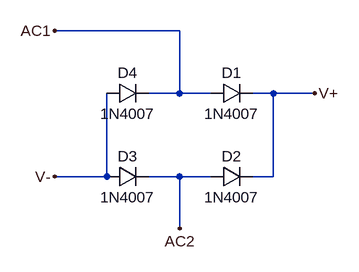
[diagram p0: schematic Rectificador de onda completa.asc]
Rectificador de onda completa.asc, the LTspice schematic file:
Version 4
SHEET 1 880 680
WIRE 160 32 -32 32
WIRE 160 128 160 32
WIRE 160 128 112 128
WIRE 208 128 160 128
WIRE 304 128 272 128
WIRE 368 128 304 128
WIRE 48 256 48 128
WIRE 48 256 -32 256
WIRE 160 256 112 256
WIRE 208 256 160 256
WIRE 304 256 304 128
WIRE 304 256 272 256
WIRE 160 336 160 256
FLAG -32 32 AC1
FLAG -32 256 V-
FLAG 368 128 V+
FLAG 160 336 AC2
SYMBOL diode 208 144 R270
WINDOW 0 32 32 VTop 2
WINDOW 3 0 32 VBottom 2
SYMATTR InstName D1
SYMATTR Value 1N4007
SYMBOL diode 208 272 R270
WINDOW 0 32 32 VTop 2
WINDOW 3 0 32 VBottom 2
SYMATTR InstName D2
SYMATTR Value 1N4007
SYMBOL diode 48 240 M90
WINDOW 0 0 32 VBottom 2
WINDOW 3 32 32 VTop 2
SYMATTR InstName D3
SYMATTR Value 1N4007
SYMBOL diode 48 144 R270
WINDOW 0 32 32 VTop 2
WINDOW 3 0 32 VBottom 2
SYMATTR InstName D4
SYMATTR Value 1N4007

The netlist it stands for:
* Rectificador de onda completa.asc
D1 AC1 V+ 1N4007
D2 AC2 V+ 1N4007
D3 V- AC2 1N4007
D4 V- AC1 1N4007
.model D D
.lib standard.dio
.backanno
.end